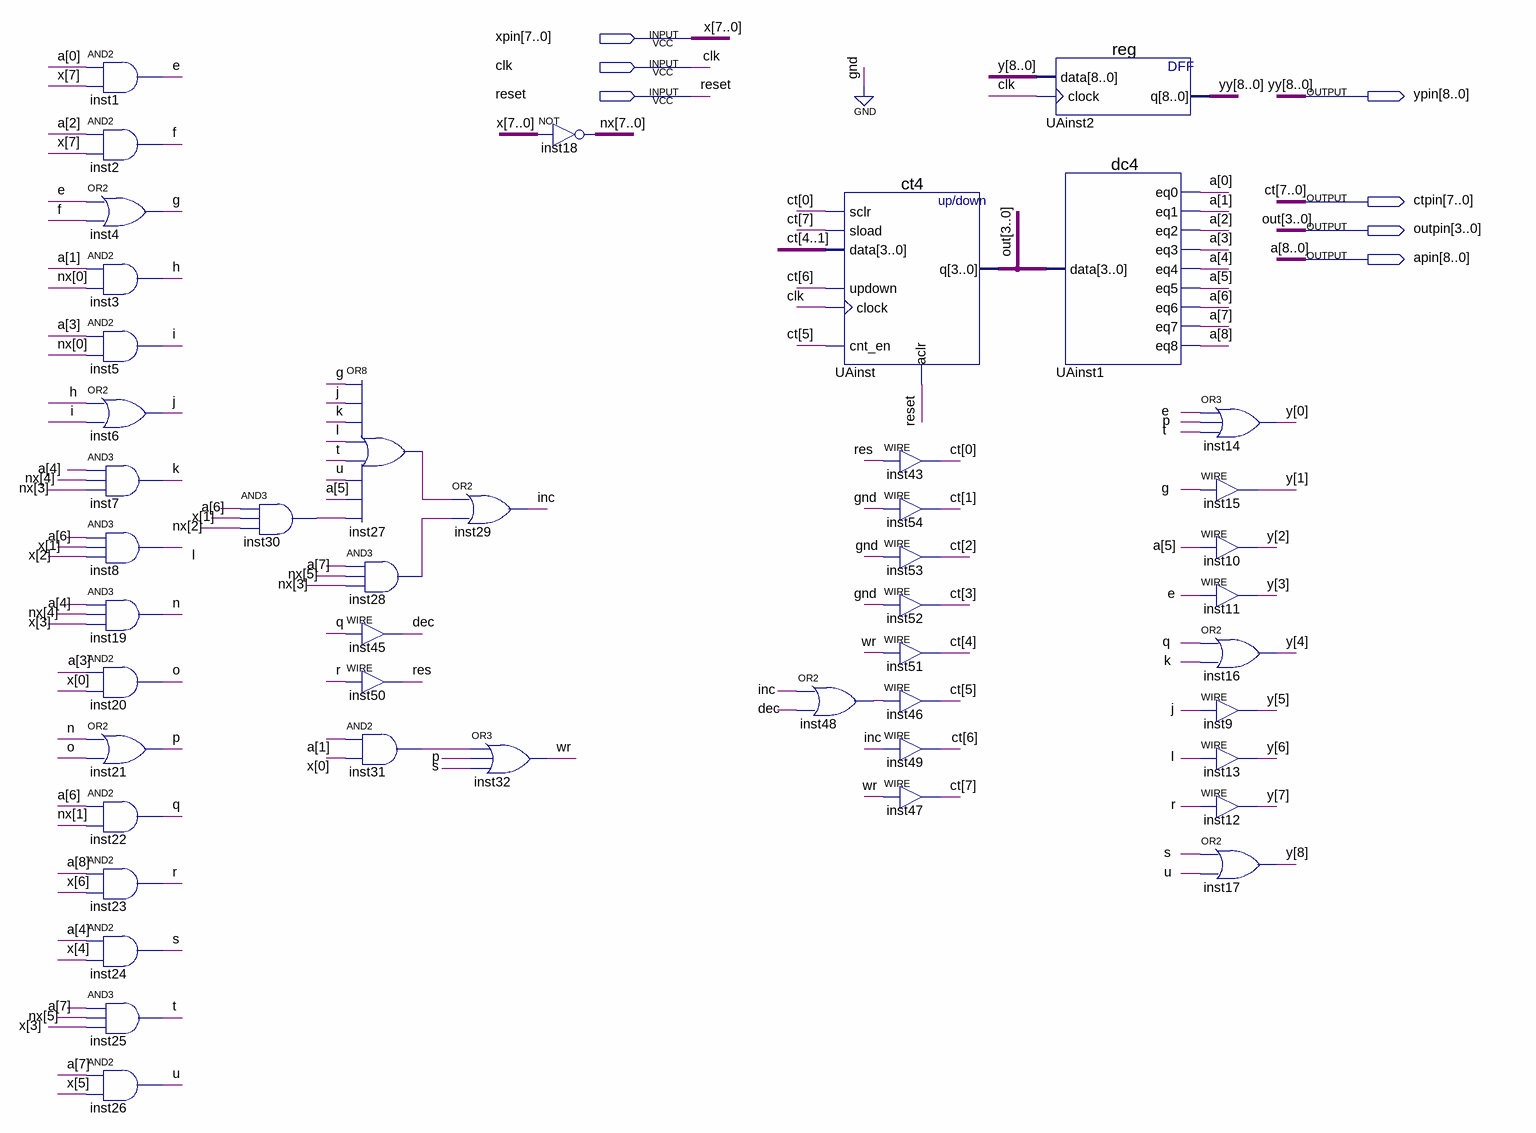
[diagram p0: schematic sheet]
// Quartus schematic UA.bdf as structural Verilog: 46 symbols, 7 pins
module UA (
  input  [7:0] xpin,
  input  clk,
  input  reset,
  output [8:0] ypin,
  output [7:0] ctpin,
  output [3:0] outpin,
  output [8:0] apin
);

  wire dec, e, f, g, h, i, inc, inst27_out, inst28_out, inst30_out, inst31_out, inst48_out, j, k, l, n, o, p,
       q, r, res, s, t, u, wr;
  wire [7:0] nx;
  wire [8:0] y;

  and inst1 (e, apin[0], xpin[7]);
  and inst2 (f, apin[2], xpin[7]);
  or inst4 (g, e, f);
  and inst3 (h, apin[1], nx[0]);
  and inst5 (i, apin[3], nx[0]);
  or inst6 (j, h, i);
  and inst7 (k, apin[4], nx[4], nx[3]);
  and inst8 (l, apin[6], xpin[1], xpin[2]);
  and inst19 (n, apin[4], nx[4], xpin[3]);
  and inst20 (o, apin[3], xpin[0]);
  or inst21 (p, n, o);
  and inst22 (q, apin[6], nx[1]);
  and inst23 (r, apin[8], xpin[6]);
  and inst24 (s, apin[4], xpin[4]);
  and inst25 (t, apin[7], nx[5], xpin[3]);
  and inst26 (u, apin[7], xpin[5]);
  and inst30 (inst30_out, apin[6], xpin[1], nx[2]);
  or inst27 (inst27_out, g, j, k, l, t, u, apin[5], inst30_out);
  and inst28 (inst28_out, apin[7], nx[5], nx[3]);
  assign dec = q;  // WIRE inst45
  assign res = r;  // WIRE inst50
  and inst31 (inst31_out, apin[1], xpin[0]);
  or inst29 (inc, inst27_out, inst28_out);
  or inst32 (wr, inst31_out, p, s);
  assign nx = ~xpin;  // NOT inst18, 8 bits wide
  or inst48 (inst48_out, inc, dec);
  ct4 UAinst (
    .sclr(ctpin[0]), .sload(ctpin[7]), .data(ctpin[4:1]), .updown(ctpin[6]), .clock(clk), .cnt_en(ctpin[5]),
    .aclr(reset), .q(outpin));
  assign ctpin[0] = res;  // WIRE inst43
  assign ctpin[1] = 1'b0;  // WIRE inst54
  assign ctpin[2] = 1'b0;  // WIRE inst53
  assign ctpin[3] = 1'b0;  // WIRE inst52
  assign ctpin[4] = wr;  // WIRE inst51
  assign ctpin[5] = inst48_out;  // WIRE inst46
  assign ctpin[6] = inc;  // WIRE inst49
  assign ctpin[7] = wr;  // WIRE inst47
  \reg  UAinst2 (.data(y), .clock(clk), .q(ypin));
  dc4 UAinst1 (
    .data(outpin), .eq0(apin[0]), .eq1(apin[1]), .eq2(apin[2]), .eq3(apin[3]), .eq4(apin[4]), .eq5(apin[5]),
    .eq6(apin[6]), .eq7(apin[7]), .eq8(apin[8]));
  or inst14 (y[0], e, p, t);
  assign y[1] = g;  // WIRE inst15
  assign y[2] = apin[5];  // WIRE inst10
  assign y[3] = e;  // WIRE inst11
  or inst16 (y[4], q, k);
  assign y[5] = j;  // WIRE inst9
  assign y[6] = l;  // WIRE inst13
  assign y[7] = r;  // WIRE inst12
  or inst17 (y[8], s, u);

  // Other names for the same wires on the sheet: a[8:0] = apin; ct[7:0] = ctpin; out[3:0] = outpin; x[7:0] = xpin;
  //   yy[8:0] = ypin
endmodule
